# EAGLE schematic Logic-Board (EAGLE 9.6.0)
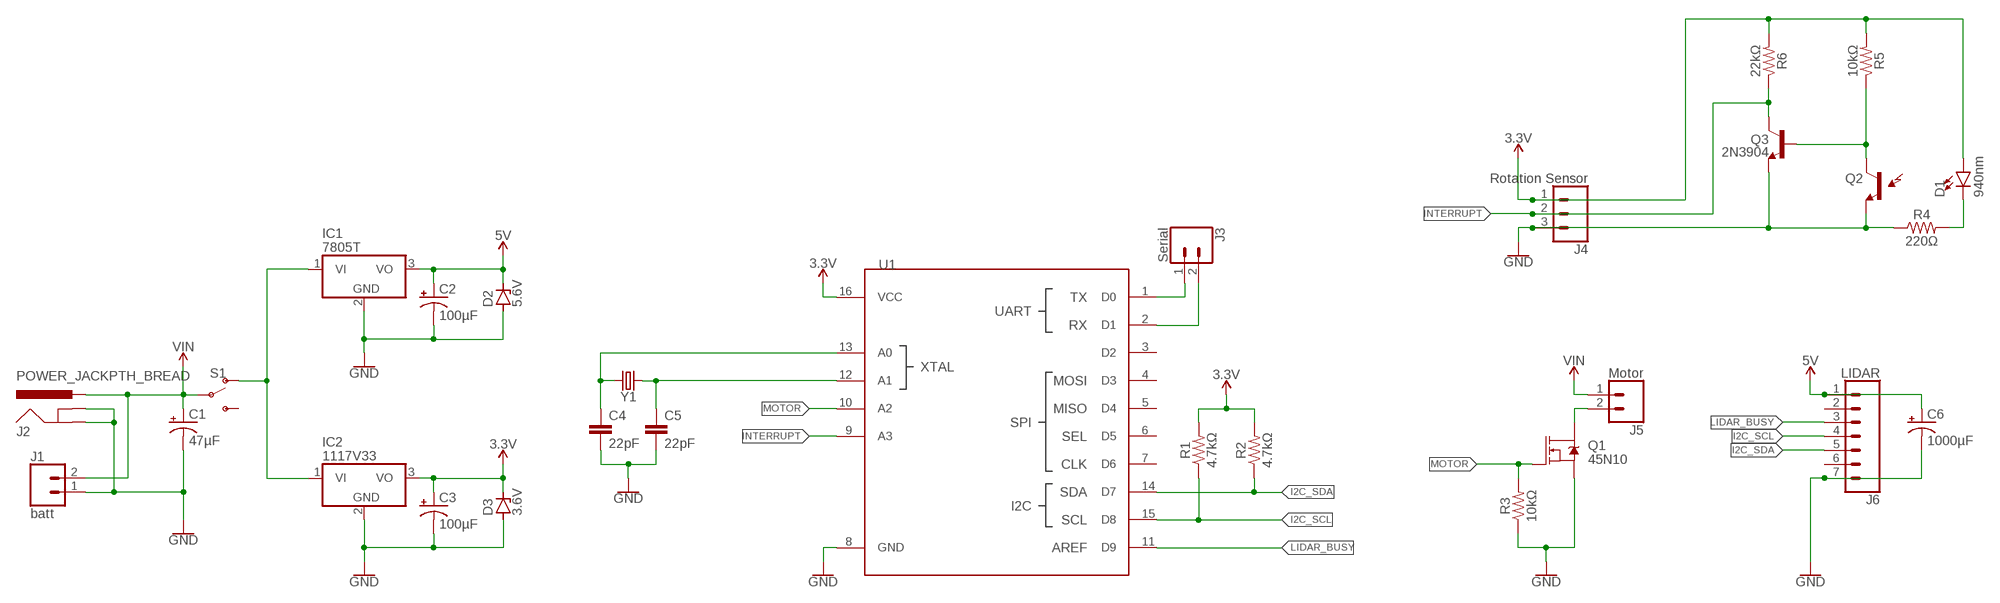
[diagram p0: schematic, sheet 1]

## Parts
C1  47µF  CPOL-USE3.5-10  [E3,5-10]
C2  100µF  CPOL-USE3.5-10  [E3,5-10]
C3  100µF  CPOL-USE3.5-10  [E3,5-10]
C4  22pF  C2,5-3  [C2.5-3]
C5  22pF  C2,5-3  [C2.5-3]
C6  1000µF  CPOL-USE3.5-10  [E3,5-10]
D1  940nm  LED-3MM-NO_SILK  [LED_3MM-NS]
D2  5.6V  ZENER-DIODEDO41Z10  [DO41Z10]
D3  3.6V  ZENER-DIODEDO41Z10  [DO41Z10]
IC1  7805T  [TO220H]
IC2  1117V33  7805T  [TO220H]
J1  batt  CONN_02POLAR_LOCK  [MOLEX-1X2_LOCK]
J2  POWER_JACKPTH_BREAD  [POWER_JACK_PTH_BREAD]
J3  Serial  CONN_02POLAR_LOCK  [MOLEX-1X2_LOCK]
J4  Rotation Sensor  CONN_03POLAR  [MOLEX-1X3]
J5  Motor  CONN_02POLAR_LOCK  [MOLEX-1X2_LOCK]
J6  LIDAR  CONN_07  [1X07]
Q1  45N10  MOSFET-NCH-FQP30N06L  [TO220V]
Q2  LTR-301  [LTR-301]
Q3  2N3904  TRANS_NPN-2N3904  [TO-92]
R1  4.7kΩ  1KOHM-HORIZ_KIT-1/4W-1%  [AXIAL-0.3-KIT]
R2  4.7kΩ  1KOHM-HORIZ_KIT-1/4W-1%  [AXIAL-0.3-KIT]
R3  10kΩ  1KOHM-HORIZ_KIT-1/4W-1%  [AXIAL-0.3-KIT]
R4  220Ω  1KOHM-HORIZ_KIT-1/4W-1%  [AXIAL-0.3-KIT]
R5  10kΩ  1KOHM-HORIZ_KIT-1/4W-1%  [AXIAL-0.3-KIT]
R6  22kΩ  1KOHM-HORIZ_KIT-1/4W-1%  [AXIAL-0.3-KIT]
S1  SWITCH-SPDT-PTH-11.6X4.0MM  [SWITCH_SPDT_PTH_11.6X4.0MM]
U1  OSHCHIP  [SOCKET-16]
Y1  CRYSTALPTH-3X8  [CRYSTAL-PTH-3X8-CYL]

## Nets
3.3V: C3.+ D1.A D3.C IC2.3(VO) J4.1 R1.P$2 R2.P$2 R5.P$2 R6.P$2 U1.16(VCC)
5V: C2.+ C6.+ D2.C IC1.3(VO) J6.1
GND: C1.- C2.- C3.- C4.2 C5.2 C6.- D2.A D3.A IC1.2(GND) IC2.2(GND) J1.1 J2.GND J2.GNDBREAK J4.3 J6.7 Q1.3(S) Q2.E(E1) Q3.1(E) R3.P$1 R4.P$1 U1.8(GND)
I2C_SCL: J6.4 R1.P$1 U1.15(D8)
I2C_SDA: J6.5 R2.P$1 U1.14(D7)
INTERRUPT: J4.2 Q3.3(C) R6.P$1 U1.9(A3)
LIDAR_BUSY: J6.3 U1.11(D9)
MOTOR: Q1.1(G) R3.P$2 U1.10(A2)
N$1: IC1.1(VI) IC2.1(VI) S1.1(O)
N$2: C4.1 U1.13(A0) Y1.2
N$3: J3.2 U1.2(D1)
N$4: C5.1 U1.12(A1) Y1.1
N$5: J3.1 U1.1(D0)
N$6: J5.2 Q1.2(D)
N$7: Q2.C(C1) Q3.2(B) R5.P$1
N$11: D1.K(C) R4.P$2
VIN: C1.+ J1.2 J2.PWR J5.1 S1.2(P)
Unconnected: J6.2 J6.6 S1.3(S) U1.3(D2) U1.4(D3) U1.5(D4) U1.6(D5) U1.7(D6)

## Library data of the parts
C1-C3 C6 = adafruit:CPOL-US: POLARIZED CAPACITOR, American symbol
C4 C5 = capacitor-wima:C: CAPACITOR naming: grid - package width
D1 = SparkFun-LED:LED: LED (Generic) Standard schematic elements and footprints for 5mm, 3mm, 1206, and 0603 sized LEDs. Generic LEDs with no color specified.
D2 D3 = diode:ZENER-DIODE: Z-Diode
IC1 IC2 = linear:78*: Positive VOLTAGE REGULATOR Source: http://cache.national.com/ds/LM/LM78L05.pdf http://www.fairchildsemi.com/ds/LM/LM7805.pdf
J1 J3 J5 = SparkFun-Connectors:CONN_02: Multi connection point. Often used as Generic Header-pin footprint for 0.1 inch spaced/style header connections On any of the 0.1 inch spaced packages, you can populate with these: Break Away Headers - Straight <https://www.sparkfun.com/products/116> (PRT-00116) Break Away Male Headers - Right Angle <https://www.sparkfun.com/products/553> (PRT-00553) Female Headers <https://www.sparkfun.com/products/115> (PRT-00115) Break Away Headers - Machine Pin <https://www.sparkfun.com/products/117> (PRT-00117) Break Away Female Headers - Swiss Machine Pin <https://www.sparkfun.com/products/743> (PRT-00743) For SCREWTERMINALS and SPRING TERMINALS visit here: Screw Terimnals on SparkFun.com <https://www.sparkfun.com/search/results?term=Screw+Terminals> (5mm/3.5mm/2.54mm spacing) This device is also useful as a general connection point to wire up your design to another part of your project. Our various solder wires solder well into these plated through hole pads. Hook-Up Wire - Assortment (Stranded, 22 AWG) <https://www.sparkfun.com/products/11375> (PRT-11375) Hook-Up Wire - Assortment (Solid Core, 22 AWG) <https://www.sparkfun.com/products/11367> (PRT-11367) View the entire wire category on our website here <https://www.sparkfun.com/categories/141> Special notes: Molex polarized connector foot print use with: PRT-08233 with associated crimp pins and housings. 2.54_SCREWTERM for use with PRT-10571. 3.5mm Screw Terminal footprints for PRT-08084 5mm Screw Terminal footprints for use with PRT-08432; SF_ID: PRT-09918
J2 = SparkFun-Connectors:POWER_JACK: Power Jack Connector This is the standard 5.5mm barrel jack for power. The PTH is the most common, proven, reliable, footprint. The Slot footprint only works if the mill layer is transmitted to the PCB fab house so be warned. Here are the connectors we sell at SparkFun: DC Barrel Power Jack/Connector <https://www.sparkfun.com/products/119> (PRT-00119) DC Barrel Power Jack/Connector (SMD) <https://www.sparkfun.com/products/12748> (PRT-12748) DC Barrel Jack Adapter - Breadboard Compatible <https://www.sparkfun.com/products/10811> (PRT-10811) It is used on this SparkFun product (and many, many others): SparkFun RedBoard - Programmed with Arduino <https://www.sparkfun.com/products/12757> (DEV-12757) Also, if you need a mating power supply or connector, please check these out: Wall Adapter Power Supply - 9VDC 650mA <https://www.sparkfun.com/products/298> (TOL-00298) DC Barrel Jack Adapter - Male <https://www.sparkfun.com/products/10287> (PRT-10287); PROD_ID: PRT-10811
J4 = SparkFun-Connectors:CONN_03: Multi connection point. Often used as Generic Header-pin footprint for 0.1 inch spaced/style header connections On any of the 0.1 inch spaced packages, you can populate with these: Break Away Headers - Straight <https://www.sparkfun.com/products/116> (PRT-00116) Break Away Male Headers - Right Angle <https://www.sparkfun.com/products/553> (PRT-00553) Female Headers <https://www.sparkfun.com/products/115> (PRT-00115) Break Away Headers - Machine Pin <https://www.sparkfun.com/products/117> (PRT-00117) Break Away Female Headers - Swiss Machine Pin <https://www.sparkfun.com/products/743> (PRT-00743) Stackable Header - 3 Pin (Female, 0.1") <https://www.sparkfun.com/products/13875> (PRT-13875) For SCREWTERMINALS and SPRING TERMINALS visit here: Screw Terimnals on SparkFun.com <https://www.sparkfun.com/search/results?term=Screw+Terminals> (5mm/3.5mm/2.54mm spacing) This device is also useful as a general connection point to wire up your design to another part of your project. Our various solder wires solder well into these plated through hole pads. Hook-Up Wire - Assortment (Stranded, 22 AWG) <https://www.sparkfun.com/products/11375> (PRT-11375) Hook-Up Wire - Assortment (Solid Core, 22 AWG) <https://www.sparkfun.com/products/11367> (PRT-11367) View the entire wire category on our website here <https://www.sparkfun.com/categories/141> Special notes: Molex polarized connector foot print use with SKU : PRT-08232 with associated crimp pins and housings.; PROD_ID: CONN-08625; SF_ID: PRT-08096
J6 = SparkFun-Connectors:CONN_07: Multi connection point. Often used as Generic Header-pin footprint for 0.1 inch spaced/style header connections On any of the 0.1 inch spaced packages, you can populate with these: Break Away Headers - Straight <https://www.sparkfun.com/products/116> (PRT-00116) Break Away Male Headers - Right Angle <https://www.sparkfun.com/products/553> (PRT-00553) Female Headers <https://www.sparkfun.com/products/115> (PRT-00115) Break Away Headers - Machine Pin <https://www.sparkfun.com/products/117> (PRT-00117) Break Away Female Headers - Swiss Machine Pin <https://www.sparkfun.com/products/743> (PRT-00743) For SCREWTERMINALS and SPRING TERMINALS visit here: Screw Terimnals on SparkFun.com <https://www.sparkfun.com/search/results?term=Screw+Terminals> (5mm/3.5mm/2.54mm spacing) This device is also useful as a general connection point to wire up your design to another part of your project. Our various solder wires solder well into these plated through hole pads. Hook-Up Wire - Assortment (Stranded, 22 AWG) <https://www.sparkfun.com/products/11375> (PRT-11375) Hook-Up Wire - Assortment (Solid Core, 22 AWG) <https://www.sparkfun.com/products/11367> (PRT-11367) View the entire wire category on our website here <https://www.sparkfun.com/categories/141> Special notes: Molex polarized connector foot print use with SKU : PRT-08231 with associated crimp pins and housings. 1MM SMD Version SKU: PRT-10208 NOTES ON THE VARIANTS LOCK and LOCK_LONGPADS... This footprint was designed to help hold the alignment of a through-hole component (i.e. 6-pin header) while soldering it into place. You may notice that each hole has been shifted either up or down by 0.005 of an inch from it's more standard position (which is a perfectly straight line). This slight alteration caused the pins (the squares in the middle) to touch the edges of the holes. Because they are alternating, it causes a "brace" to hold the component in place. 0.005 has proven to be the perfect amount of "off-center" position when using our standard breakaway headers. Although looks a little odd when you look at the bare footprint, once you have a header in there, the alteration is very hard to notice. Also,if you push a header all the way into place, it is covered up entirely on the bottom side.
Q1 = SparkFun-DiscreteSemi:MOSFET-NCH: N-channel MOSFETs Voltage controlled devices that allow control of high current outputs. SparkFun Products: SparkFun OpenScale <https://www.sparkfun.com/products/13261> SparkFun Digital Sandbox <https://www.sparkfun.com/products/12651> SparkFun Monster Moto Shield <https://www.sparkfun.com/products/10182> SparkFun MOSFET Power Controller <https://www.sparkfun.com/products/11214>; PROD_ID: TRANS-10060; VALUE: 60V/32A/35mΩ
Q2 = SparkFun-Sensors:LTR-301: LiteOn LTR-301 IR Phototransistor (Side-Receiving) Side-looking Infrared detectors. These simple devices operate at 940nm and work well for generic IR systems including remote control and touch-less object sensing. Using a simple ADC on any microcontroller will allow variable readings to be collected from the detector. Datasheet <http://www.sparkfun.com/datasheets/Components/LTR-301.pdf> SparkFun Products Infrared Emitters and Detectors <https://www.sparkfun.com/products/241> (SEN-00241); PROD_ID: DIO-10904; SF_ID: SEN-00241
Q3 = SparkFun-DiscreteSemi:TRANS_NPN: NPN transistor Current controlled devices typically used to amplify current or used as a switch. BC547 - COM-08928 <http://www.sparkfun.com/products/8928> (TO-92 45V 100mA) (1.Collector 2.Base 3.Emitter) 2N3904 - COM-00521 <http://www.sparkfun.com/products/521> (TO-92 40V 200mA) (1.Emitter 2.Base 3.Collector) P2N2222A - COM-12852 <http://www.sparkfun.com/products/12852> (TO-92 40V 600mA) (1.Collector 2.Base 3.Emitter); PROD_ID: TRANS-08447; VALUE: 200mA/40V
R1-R6 = SparkFun-Resistors:1KOHM: 1kΩ resistor A resistor is a passive two-terminal electrical component that implements electrical resistance as a circuit element. Resistors act to reduce current flow, and, at the same time, act to lower voltage levels within circuits. - Wikipedia; PROD_ID: RES-12182; VALUE: 1k
S1 = SparkFun-Switches:SWITCH-SPDT: Single Pole, Double Throw (SPDT) Switch Single-pole, double-throw (SPDT) switch. Variant Overview SMD-AYZ0202 Surface Mount DPDT Switch <https://www.sparkfun.com/products/597> (COM-00597) Used on e.g. LilyPad Arduino USB - ATmega32U4 Board <https://www.sparkfun.com/products/12049> PTH-11.6X4.0MM SPDT Mini Power Switch <https://www.sparkfun.com/products/102> (COM-00102) Used on e.g. SparkFun Simon Says - Through-Hole Soldering Kit <https://www.sparkfun.com/products/10547> (KIT-10547) PTH-11.6X4.0MM-KIT KIT version of SPDT Mini Power Switch - Simplifies soldering by removing tStop of switch pins - only one side can be soldered. PTH-11.6X4.0MM-LOCK LOCK version of SPDT Mini Power Switch - Offset pins hold switch in place for easier soldering. SMD-RIGHT-ANGLE Surface Mount Right Angle Switch <https://www.sparkfun.com/products/10860> (COM-10860) Used on e.g. SparkFun ESP8266 Thing <https://www.sparkfun.com/products/13231>; PROD_ID: SWCH-08261; SF_SKU: COM-00102
U1 = OSHChip:OSHCHIP: Nordic nRF51822-based microcontroller board The OSHChip <http://oshchip.org> is an open-source hardware microcontroller board in a DIP-16 form factor. Specifications: ARM Cortex-M0 32 bit processor running at 16 MHz 2.4 GHz Bluetooth Low Energy radio Broad range of built-in Peripheral functions 256 KBytes of Flash memory for program and data 32 KBytes of SRAM Miniature packaging, compatible with bread board construction Support for in-system debugging including breakpoints
Y1 = SparkFun-Clocks:CRYSTAL: Crystals (Generic) These are passive quartz crystals, which can be used as a clock source for a microcontroller. Crystal's are two-terminal devices. They require external "load" capacitors to generate an oscillating signal.